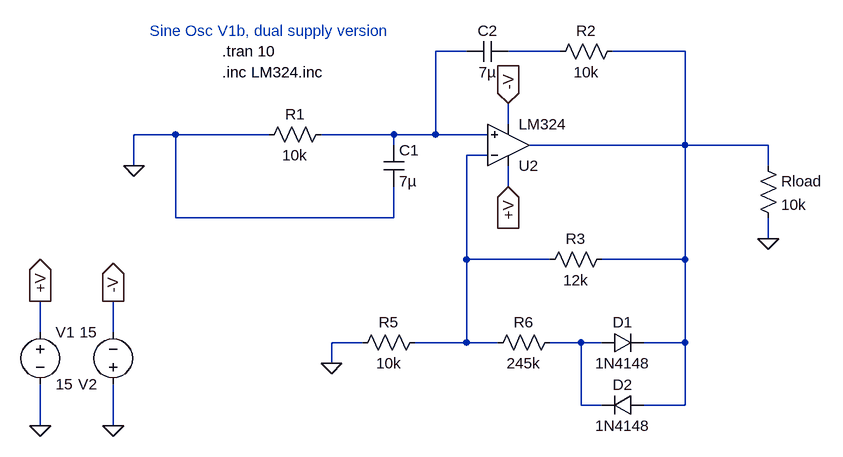
[diagram p0: schematic Sine_Osc_v1b.asc]
Sine_Osc_v1b.asc, the LTspice schematic file:
Version 4
SHEET 1 880 680
WIRE 144 -400 96 -400
WIRE 288 -400 208 -400
WIRE 480 -400 368 -400
WIRE 208 -288 208 -320
WIRE -304 -272 -368 -272
WIRE -160 -272 -304 -272
WIRE 32 -272 -80 -272
WIRE 96 -272 96 -400
WIRE 96 -272 32 -272
WIRE 176 -272 96 -272
WIRE 32 -256 32 -272
WIRE 480 -256 480 -400
WIRE 480 -256 240 -256
WIRE 608 -256 480 -256
WIRE 176 -240 144 -240
WIRE -368 -224 -368 -272
WIRE 608 -224 608 -256
WIRE 208 -192 208 -224
WIRE -304 -144 -304 -272
WIRE 32 -144 32 -192
WIRE 32 -144 -304 -144
WIRE 608 -112 608 -144
WIRE 144 -80 144 -240
WIRE 272 -80 144 -80
WIRE 480 -80 480 -256
WIRE 480 -80 352 -80
WIRE -512 32 -512 -16
WIRE -400 32 -400 -16
WIRE -16 48 -64 48
WIRE 144 48 144 -80
WIRE 144 48 64 48
WIRE 192 48 144 48
WIRE 320 48 272 48
WIRE 352 48 320 48
WIRE 480 48 480 -80
WIRE 480 48 416 48
WIRE -64 80 -64 48
WIRE 320 144 320 48
WIRE 352 144 320 144
WIRE 480 144 480 48
WIRE 480 144 416 144
WIRE -512 176 -512 112
WIRE -400 176 -400 112
FLAG -512 176 0
FLAG -512 -16 +V
IOPIN -512 -16 Out
FLAG 208 -192 +V
IOPIN 208 -192 In
FLAG 608 -112 0
FLAG -400 176 0
FLAG -400 -16 -V
IOPIN -400 -16 Out
FLAG 208 -320 -V
IOPIN 208 -320 In
FLAG -368 -224 0
FLAG -64 80 0
SYMBOL voltage -512 16 R0
WINDOW 123 0 0 Left 2
WINDOW 39 0 0 Left 2
SYMATTR InstName V1
SYMATTR Value 15
SYMBOL res -32 64 R270
WINDOW 0 32 56 VTop 2
WINDOW 3 0 56 VBottom 2
SYMATTR InstName R5
SYMATTR Value 10k
SYMBOL res 288 32 R90
WINDOW 0 0 56 VBottom 2
WINDOW 3 32 56 VTop 2
SYMATTR InstName R6
SYMATTR Value 245k
SYMBOL res -176 -256 R270
WINDOW 0 32 56 VTop 2
WINDOW 3 0 56 VBottom 2
SYMATTR InstName R1
SYMATTR Value 10k
SYMBOL res 384 -416 R90
WINDOW 0 0 56 VBottom 2
WINDOW 3 32 56 VTop 2
SYMATTR InstName R2
SYMATTR Value 10k
SYMBOL res 592 -240 R0
SYMATTR InstName Rload
SYMATTR Value 10k
SYMBOL Opamps\\opamp2 208 -192 M180
SYMATTR InstName U2
SYMATTR Value LM324
SYMATTR SpiceModel LM324
SYMBOL cap 16 -256 R0
SYMATTR InstName C1
SYMATTR Value 7µ
SYMBOL cap 208 -416 R90
WINDOW 0 0 32 VBottom 2
WINDOW 3 32 32 VTop 2
SYMATTR InstName C2
SYMATTR Value 7µ
SYMBOL res 368 -96 R90
WINDOW 0 0 56 VBottom 2
WINDOW 3 32 56 VTop 2
SYMATTR InstName R3
SYMATTR Value 12k
SYMBOL diode 416 128 R90
WINDOW 0 0 32 VBottom 2
WINDOW 3 32 32 VTop 2
SYMATTR InstName D2
SYMATTR Value 1N4148
SYMBOL diode 352 32 M90
WINDOW 0 0 32 VBottom 2
WINDOW 3 32 32 VTop 2
SYMATTR InstName D1
SYMATTR Value 1N4148
SYMBOL voltage -400 128 R180
WINDOW 123 0 0 Left 2
WINDOW 39 0 0 Left 2
SYMATTR InstName V2
SYMATTR Value 15
TEXT -232 -400 Left 2 !.tran 10
TEXT -160 -416 Bottom 2 ;Sine Osc V1b, dual supply version
TEXT -232 -368 Left 2 !.inc LM324.inc

The netlist it stands for:
* Sine_Osc_v1b.asc
V1 +V 0 15
R5 0 N004 10k
R6 N005 N004 245k
R1 0 N001 10k
R2 N003 N002 10k
Rload N003 0 10k
XU2 N001 N004 +V -V N003 LM324 LM324  ; pins In+ In- V+ V- OUT
C1 N001 0 7µ
C2 N002 N001 7µ
R3 N003 N004 12k
D2 N003 N005 1N4148
D1 N005 N003 1N4148
V2 0 -V 15
.model D D
.lib standard.dio
.tran 10
* Sine Osc V1b, dual supply version
.inc LM324.inc
.backanno
.end